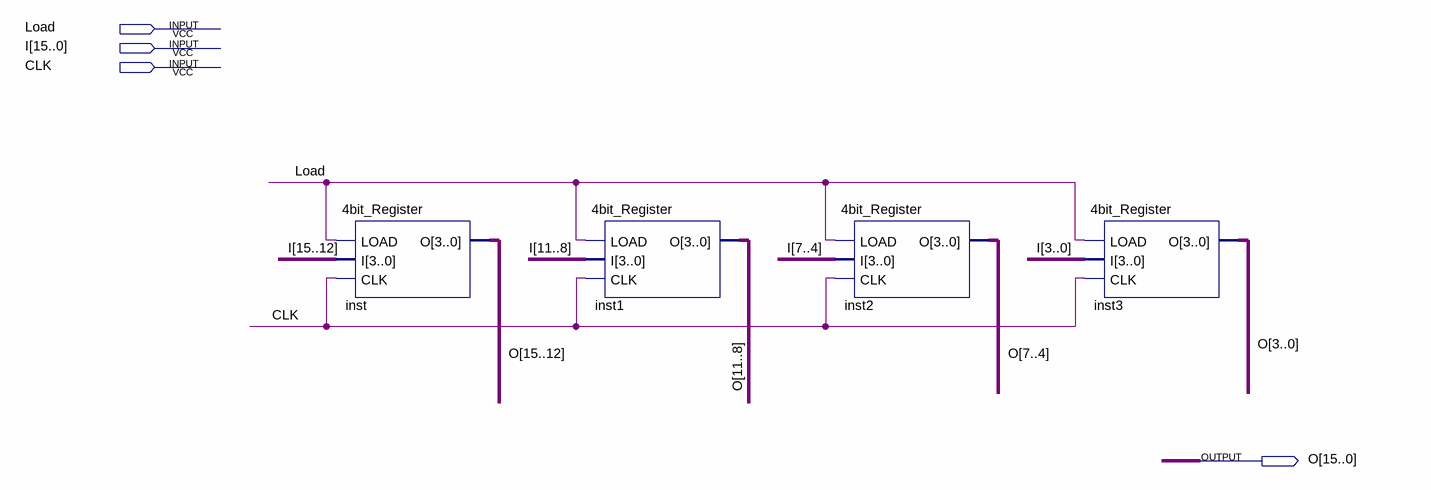
[diagram p0: schematic sheet]
// Quartus schematic 16bit_Register.bdf as structural Verilog: 4 symbols, 4 pins
module \16bit_Register  (
  input  Load,
  input  [15:0] I,
  input  CLK,
  output [15:0] O
);

  \4bit_Register  inst (.LOAD(Load), .I(I[15:12]), .CLK(CLK), .O(O[15:12]));
  \4bit_Register  inst1 (.LOAD(Load), .I(I[11:8]), .CLK(CLK), .O(O[11:8]));
  \4bit_Register  inst2 (.LOAD(Load), .I(I[7:4]), .CLK(CLK), .O(O[7:4]));
  \4bit_Register  inst3 (.LOAD(Load), .I(I[3:0]), .CLK(CLK), .O(O[3:0]));
endmodule
